# Altium schematic sheet CAN.SchDoc
size A4
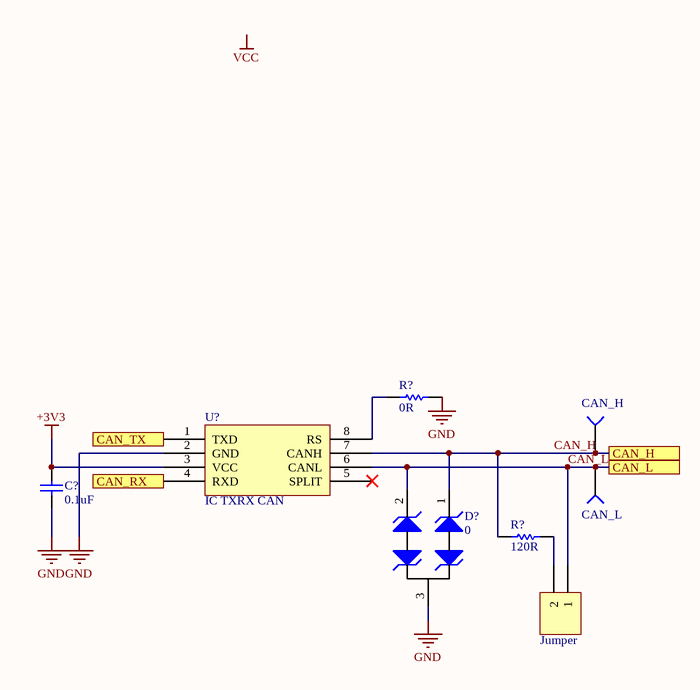
[diagram p0: CAN.SchDoc]

## Parts
(Parts that share a designator on the sheet are numbered #1, #2 ... from top to bottom, then left to right.)
?  Jumper  [HDR1X2]
C?  value 0.1uF  [CAPC0603(1608)55_N]  (hidden comment: CAP_0.1uF_16V_0603)
D?  0
R?#1  value 0R  [RESC0201(0603)_N]  (hidden comment: RES_0R_0603)
R?#2  value 120R  [RESC0201(0603)_N]  (hidden comment: RES_120R_0603)
TP?#1  CAN_H  [TESTPOINT]
TP?#2  CAN_L  [TESTPOINT]
U?  IC TXRX CAN

## Ports
CAN_H, CAN_L, CAN_RX, CAN_TX

## Nets
+3V3: C?.2 U?.3(VCC)
GND: C?.1 D?.3 R?#1.2 U?.2(GND)
CAN_H: D?.1 R?#2.1 TP?#1.1(=value) U?.7(CANH) ; port CAN_H
CAN_L: ?.1 D?.2 TP?#2.1(=value) U?.6(CANL) ; port CAN_L
CAN_RX: U?.4(RXD) ; port CAN_RX
CAN_TX: U?.1(TXD) ; port CAN_TX
Net?_2: ?.2 R?#2.2
NetR?#1_1: R?#1.1 U?.8(RS)

Not connected (* = marked no-connect by the designer): U? 5(SPLIT)*

## Notes on the sheet
- Labels drawn without touching a wire or pin: VCC

## Library data of the parts
? = Header 2: Header, 2-Pin; LatestRevisionDate: 17-Jul-2002; LatestRevisionNote: Re-released for DXP Platform.; Publisher: Altium Limited
C? = CAP_0.1uF_16V_0603: CAP CER 0.1UF 16V X7R 0603; Part Number: CC0603KRX7R7BB104; Manufacturer: Yageo; Dimensions: 0.063" L x 0.031" W (1.60mm x 0.80mm); Package: 0603 (1608 Metric); Temperature Coefficient: X7R; Voltage Rating: 16V
D? = TVS_DIODE_CAN: TVS DIODE 24V 50V SOT323-3; Part Number: PESD1CAN-UX; Manufacturer: Nexperia USA Inc.; Package: SC-70, SOT-323; ComponentLink1Description: Datasheet; ComponentLink1URL: https://assets.nexperia.com/documents/data-sheet/PESD1CAN-U.pdf
R?#1 = RES_0R_0603: RES SMD 0 OHM JUMPER 1/10W 0603; Manufacturer: Yageo; Part Number (MPN): RC0603JR-070RL; Package: 0603 (1608 Metric); Dimensions: 0.063" L x 0.031" W (1.60mm x 0.80mm)
R?#2 = RES_120R_0603: RES SMD 120 OHM 5% 1/10W 0603; Manufacturer: Yageo; Part Number (MPN): RC0603JR-07120RL; Package: 0603 (1608 Metric); Dimensions: 0.063" L x 0.031" W (1.60mm x 0.80mm); Tolerance: 5%
TP?#1 TP?#2 = TESTPOINT_SMD
U? = LTC2875: IC TXRX CAN 4MBPS 8SO; Manufacturer: Linear Technologies; Part Number: LTC2875IS8#PBF; Package: 8-SOIC (0.154", 3.90mm Width); ComponentLink1Description: Datasheet; ComponentLink1URL: https://www.analog.com/media/en/technical-documentation/data-sheets/2875f.pdf